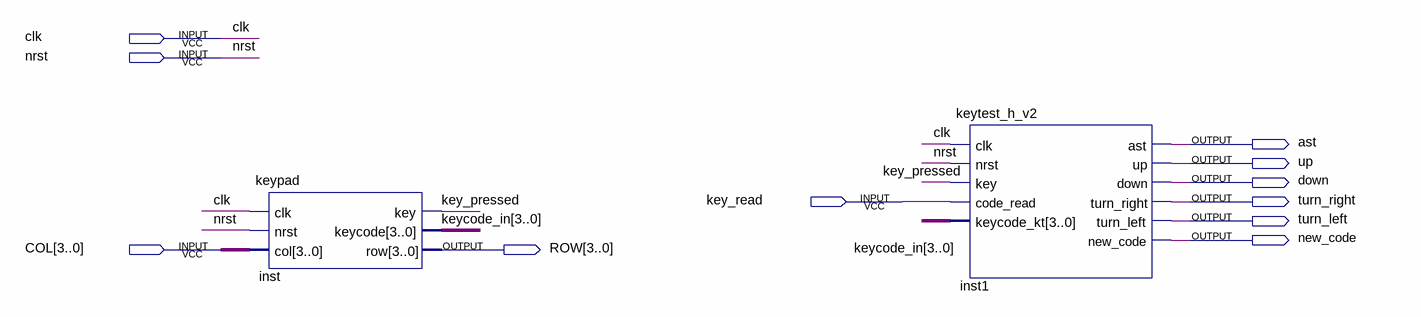
[diagram p0: schematic sheet]
// Quartus schematic keyboard_module.bdf as structural Verilog: 2 symbols, 11 pins
module keyboard_module (
  input  clk,
  input  nrst,
  input  key_read,
  input  [3:0] COL,
  output ast,
  output up,
  output down,
  output turn_right,
  output turn_left,
  output new_code,
  output [3:0] ROW
);

  wire key_pressed;
  wire [3:0] keycode_in;

  keypad inst (.clk(clk), .nrst(nrst), .col(COL), .key(key_pressed), .keycode(keycode_in), .row(ROW));
  keytest_h_v2 inst1 (
    .clk(clk), .nrst(nrst), .key(key_pressed), .code_read(key_read), .keycode_kt(keycode_in), .ast(ast),
    .up(up), .down(down), .turn_right(turn_right), .turn_left(turn_left), .new_code(new_code));
endmodule
